# Altium schematic sheet V_1.SchDoc
size A3; Organization: Altium Limited; Address1: L3, 12a Rodborough Rd; Address2: Frenchs Forest; Address3: NSW; Address4: Australia 2086
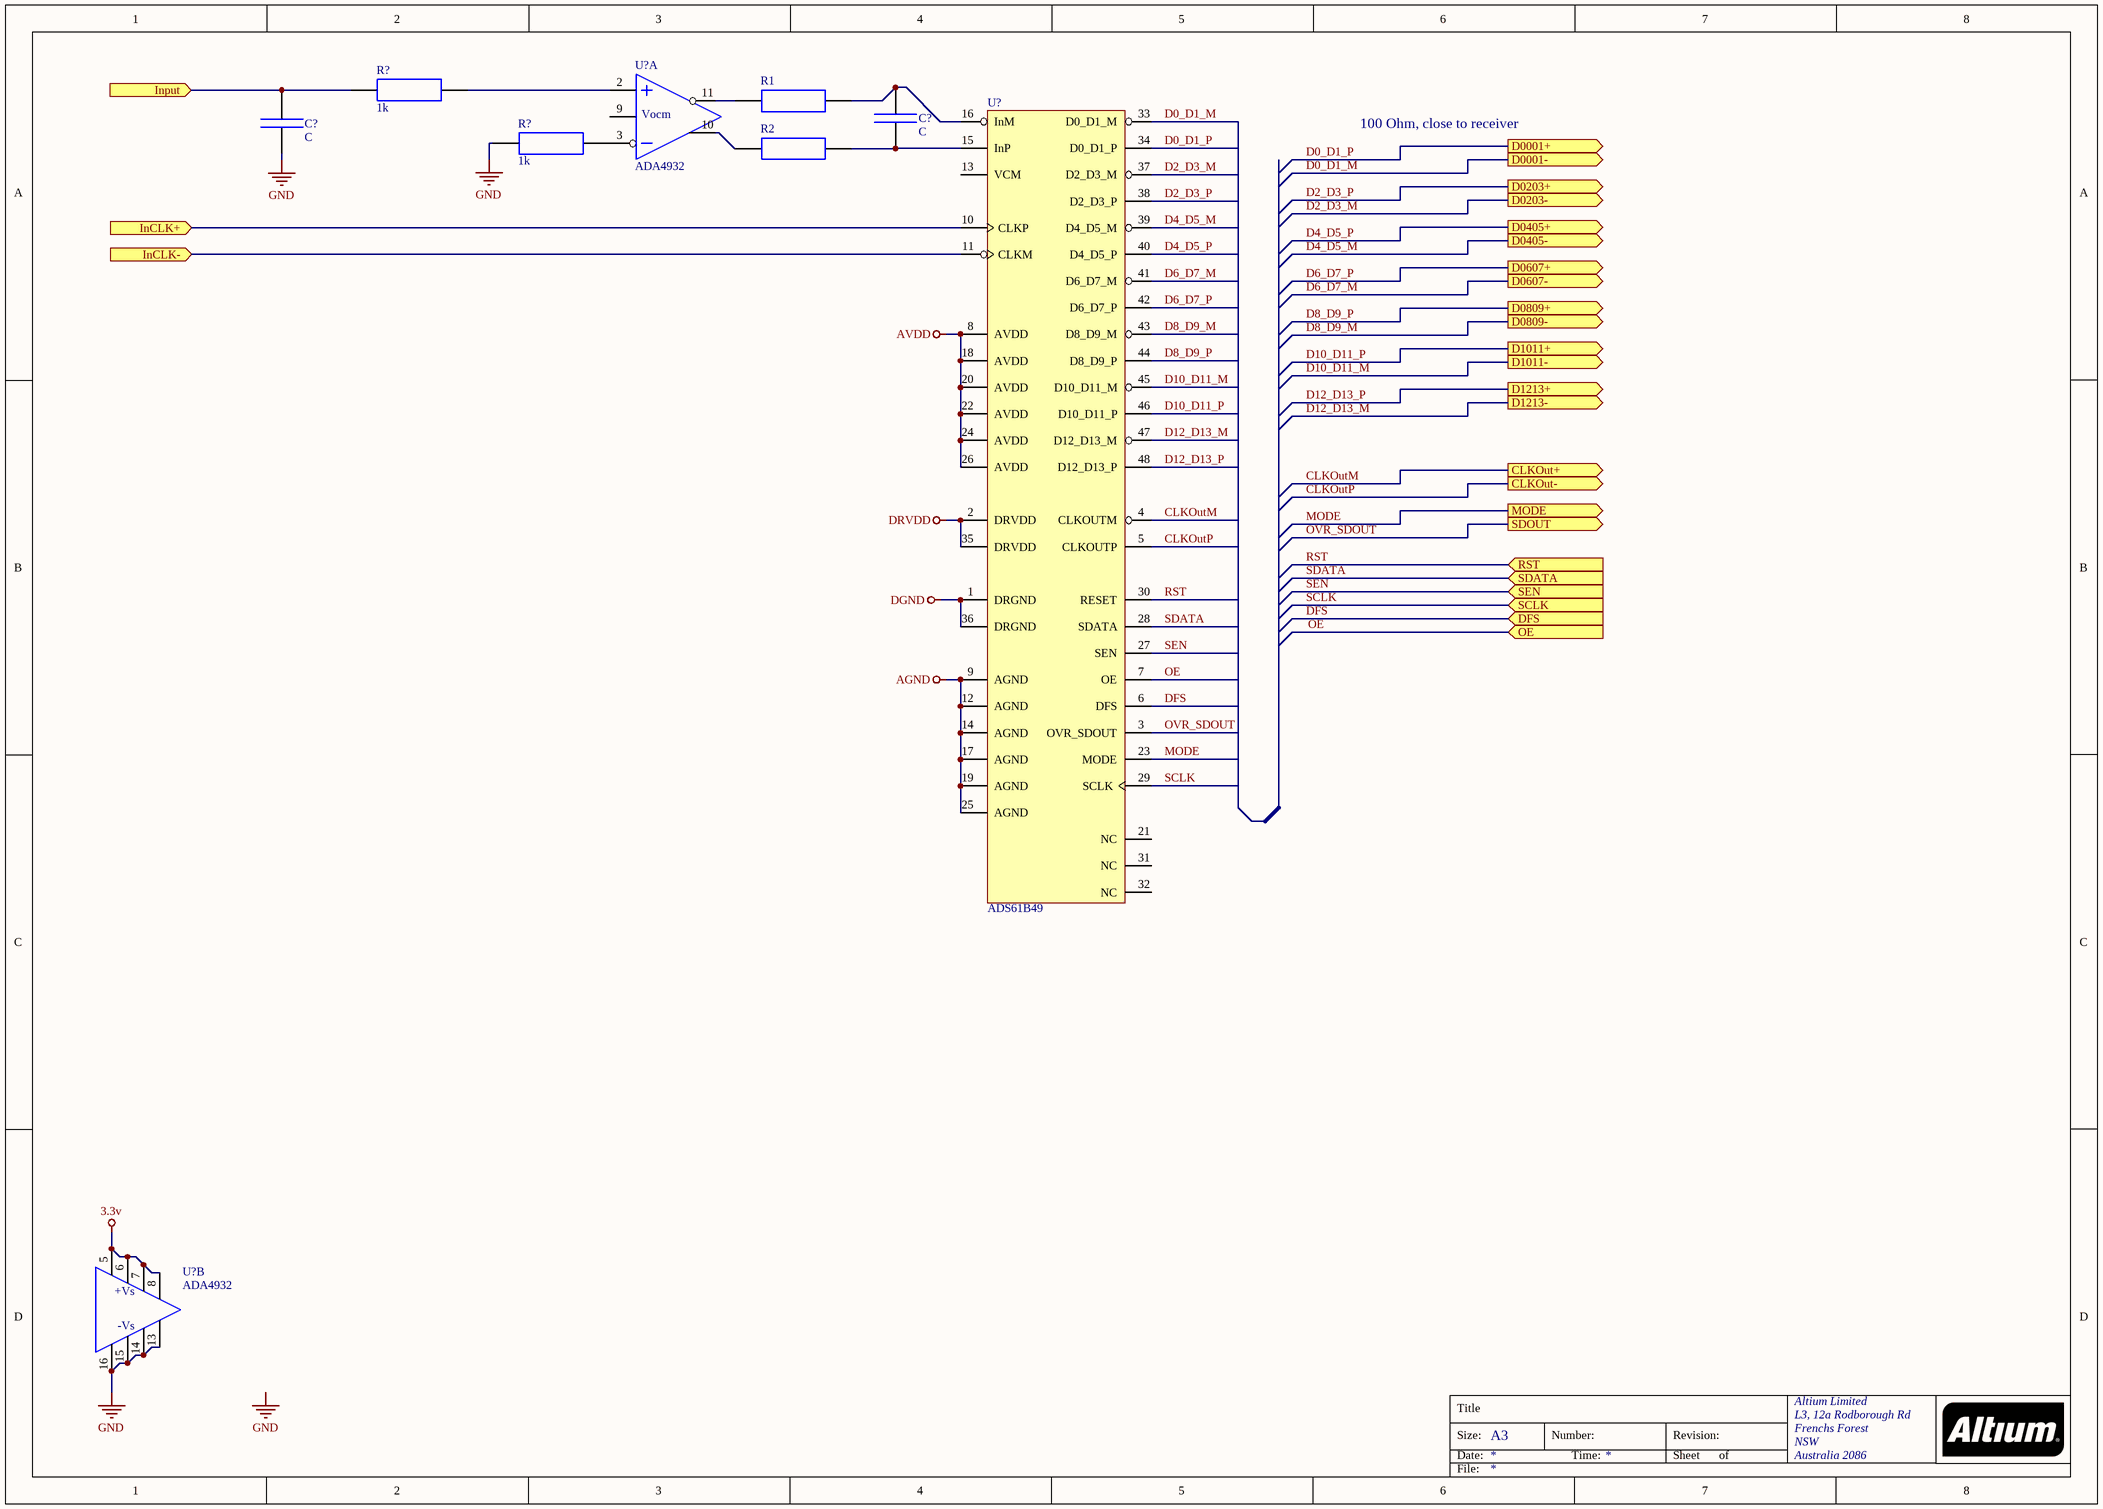
[diagram p0: V_1.SchDoc]

## Parts
(Parts that share a designator on the sheet are numbered #1, #2 ... from top to bottom, then left to right.)
C?#1  C
C?#2  C
R1  (no value)
R2  (no value)
R?#1  1k
R?#2  1k
U?#1  ADA4932  (part A of 2)
U?#2  ADS61B49
U?#3  ADA4932  (part B of 2)

## Ports
CLKOut+ (out), CLKOut- (out), D0001+ (out), D0001- (out), D0203+ (out), D0203- (out), D0405+ (out), D0405- (out), D0607+ (out), D0607- (out), D0809+ (out), D0809- (out), D1011+ (out), D1011- (out), D1213+ (out), D1213- (out), DFS (in), InCLK+ (in), InCLK- (in), Input (in), MODE (out), OE (in), RST (in), SCLK (in), SDATA (in), SDOUT (out), SEN (in)

## Nets
3.3v: U?#3.5 U?#3.6 U?#3.7 U?#3.8
AGND: U?#2.9(AGND) U?#2.12(AGND) U?#2.14(AGND) U?#2.17(AGND) U?#2.19(AGND) U?#2.25(AGND)
AVDD: U?#2.8(AVDD) U?#2.18(AVDD) U?#2.20(AVDD) U?#2.22(AVDD) U?#2.24(AVDD) U?#2.26(AVDD)
DGND: U?#2.1(DRGND) U?#2.36(DRGND)
DRVDD: U?#2.2(DRVDD) U?#2.35(DRVDD)
GND: C?#2.?2 R?#2.?1 U?#3.13 U?#3.14 U?#3.15 U?#3.16
CLKOutM: U?#2.4(CLKOUTM) ; port CLKOut+
CLKOutP: U?#2.5(CLKOUTP) ; port CLKOut-
D0_D1_M: U?#2.33(D0_D1_M) ; port D0001-
D0_D1_P: U?#2.34(D0_D1_P) ; port D0001+
D2_D3_M: U?#2.37(D2_D3_M) ; port D0203-
D2_D3_P: U?#2.38(D2_D3_P) ; port D0203+
D4_D5_M: U?#2.39(D4_D5_M) ; port D0405-
D4_D5_P: U?#2.40(D4_D5_P) ; port D0405+
D6_D7_M: U?#2.41(D6_D7_M) ; port D0607-
D6_D7_P: U?#2.42(D6_D7_P) ; port D0607+
D8_D9_M: U?#2.43(D8_D9_M) ; port D0809-
D8_D9_P: U?#2.44(D8_D9_P) ; port D0809+
D10_D11_M: U?#2.45(D10_D11_M) ; port D1011-
D10_D11_P: U?#2.46(D10_D11_P) ; port D1011+
D12_D13_M: U?#2.47(D12_D13_M) ; port D1213-
D12_D13_P: U?#2.48(D12_D13_P) ; port D1213+
DFS: U?#2.6(DFS) ; port DFS
InCLK+: U?#2.10(CLKP) ; port InCLK+
InCLK-: U?#2.11(CLKM) ; port InCLK-
Input: C?#2.?1 R?#1.?2 ; port Input
MODE: U?#2.23(MODE) ; port MODE
OE: U?#2.7(OE) ; port OE
OVR_SDOUT: U?#2.3(OVR_SDOUT) ; port SDOUT
RST: U?#2.30(RESET) ; port RST
SCLK: U?#2.29(SCLK) ; port SCLK
SDATA: U?#2.28(SDATA) ; port SDATA
SEN: U?#2.27(SEN) ; port SEN
NetC?#1_?1: C?#1.?1 R1.?2 U?#2.16(InM)
NetC?#1_?2: C?#1.?2 R2.?2 U?#2.15(InP)
NetR1_?1: R1.?1 U?#1.11
NetR2_?1: R2.?1 U?#1.10
NetR?#1_?1: R?#1.?1 U?#1.2
NetR?#2_?2: R?#2.?2 U?#1.3

Not connected (* = marked no-connect by the designer): U?#1 9; U?#2 13(VCM) 21(NC) 31(NC) 32(NC)

## Notes on the sheet
- 100 Ohm, close to receiver
- Labels drawn without touching a wire or pin: GND
- Title
- Size:
- Date:
- A3
- Number:
- Time:
- Revision:
- Sheet
- of
- File:
- (in symbol Op Amp, part A) Vocm
- (in symbol Op Amp, part B) +Vs; -Vs

## Library data of the parts
R1 R2 R?#1 R?#2 = Res
U?#1 U?#3 = Op Amp
U?#2 = ADC